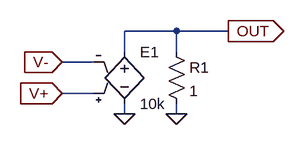
[diagram p0: schematic op-amp.asc]
op-amp.asc, the LTspice schematic file:
Version 4
SHEET 1 880 680
WIRE 160 80 80 80
WIRE 240 80 160 80
WIRE 80 112 80 80
WIRE 160 112 160 80
WIRE 32 128 -16 128
WIRE 32 176 -16 176
WIRE 80 208 80 192
WIRE 160 208 160 192
FLAG 80 208 0
FLAG 160 208 0
FLAG 240 80 OUT
IOPIN 240 80 Out
FLAG -16 128 V-
IOPIN -16 128 In
FLAG -16 176 V+
IOPIN -16 176 In
SYMBOL res 144 96 R0
SYMATTR InstName R1
SYMATTR Value 1
SYMBOL e2 80 96 R0
SYMATTR InstName E1
SYMATTR Value 10k

The netlist it stands for:
* op-amp.asc
R1 OUT 0 1
E1 OUT 0 V+ V- 10k
.backanno
.end